# EasyEDA Pro project evenVCO.eprj, schematic main_1
Board Name: main_TH; Create Date: 2025-12-28; Page Name: main; Project Name: comparatorVCO; Schematic Name: main_1; Update Date: 2025-12-28; Company: EasyEDA.com; Page Size: A4; Version: V1.0
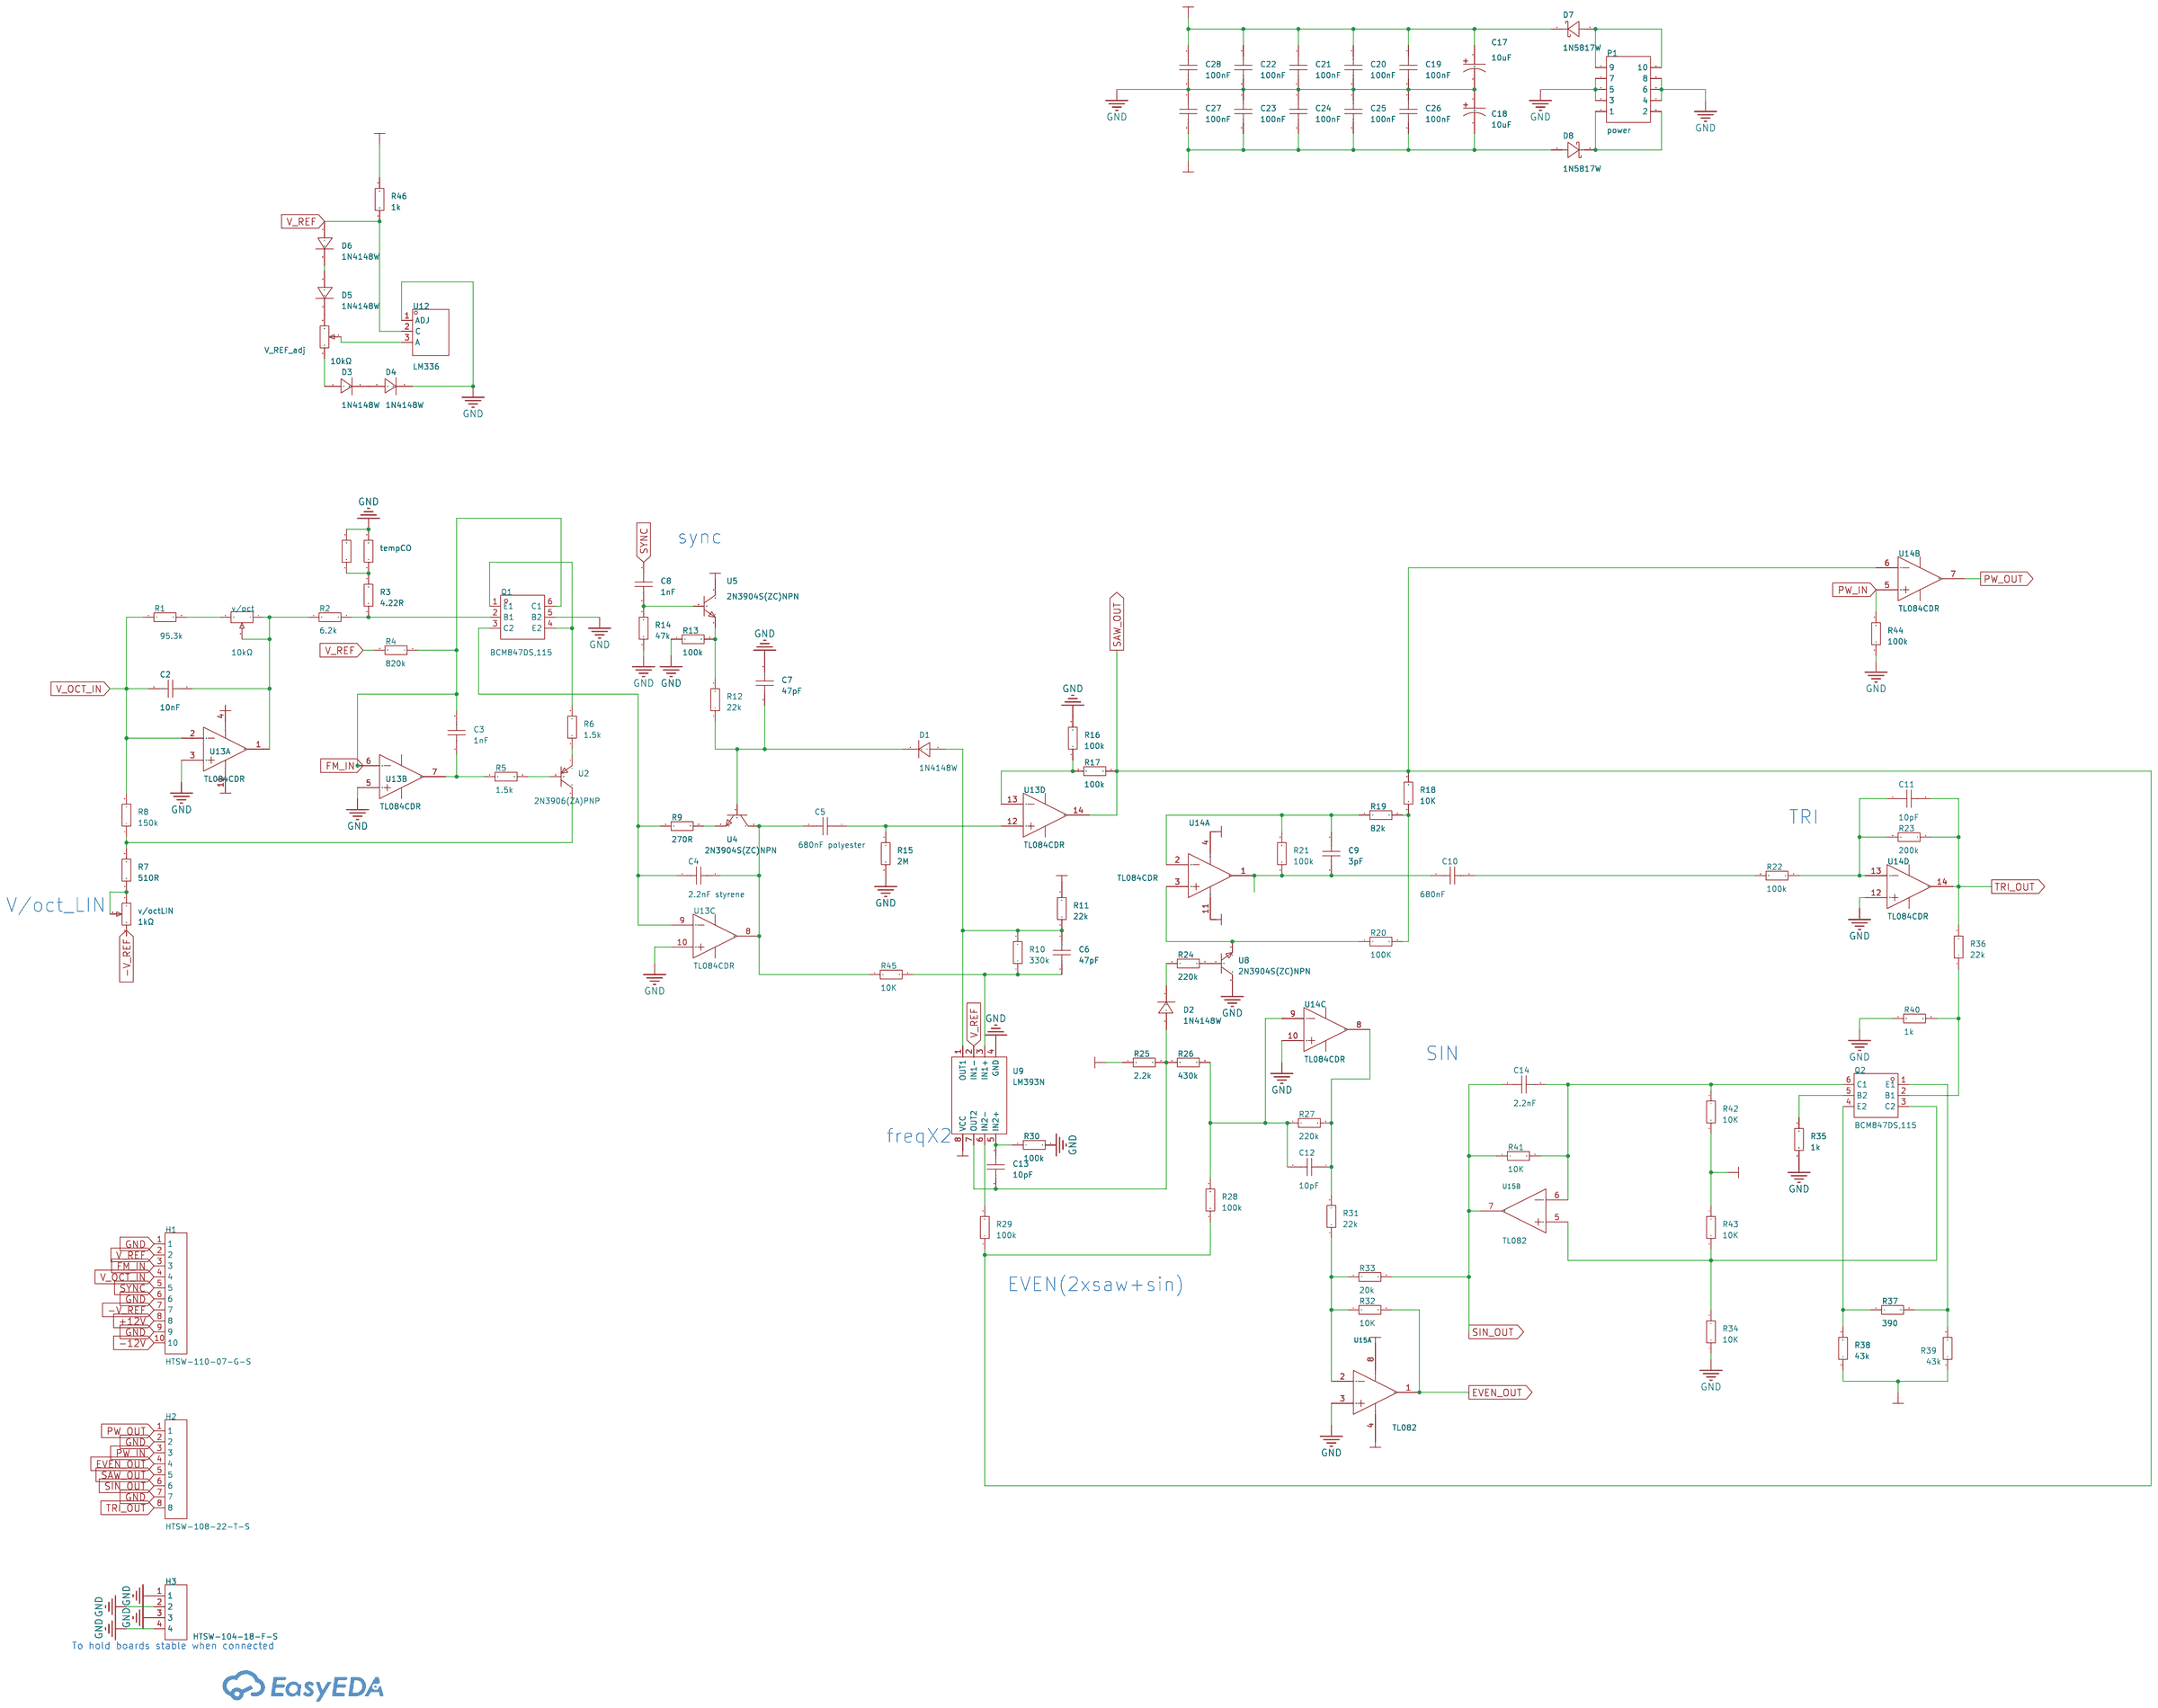
[diagram p2: schematic sheet]

## Parts
C2  10nF  [CAP-TH_L2.5-W2.3-P1.80-D0.4]
C3  1nF  [CAP-TH_L2.5-W2.3-P1.80-D0.4]
C4  2.2nF styrene  [CAP-TH_L5.0-W2.1-P4.60-D0.4]
C5  680nF polyester  [CAP-TH_L5.0-W2.1-P4.60-D0.4]
C6  47pF  [CAP-TH_L2.5-W2.3-P1.80-D0.4]
C7  47pF  [CAP-TH_L2.5-W2.3-P1.80-D0.4]
C8  1nF  [CAP-TH_L2.5-W2.3-P1.80-D0.4]
C9  3pF  [CAP-TH_L2.5-W2.3-P1.80-D0.4]
C10  680nF  [CAP-TH_L5.0-W2.1-P4.60-D0.4]
C11  10pF  [CAP-TH_L2.5-W2.3-P1.80-D0.4]
C12  10pF  [CAP-TH_L2.5-W2.3-P1.80-D0.4]
C13  10pF  [CAP-TH_L2.5-W2.3-P1.80-D0.4]
C14  2.2nF  [CAP-TH_L5.0-W2.1-P4.60-D0.4]
C17  10uF  [CAP-TH_L2.5-W2.3-P1.80-D0.4]
C18  10uF  [CAP-TH_L2.5-W2.3-P1.80-D0.4]
C19  100nF  [CAP-TH_L2.5-W2.3-P1.80-D0.4]
C20  100nF  [CAP-TH_L2.5-W2.3-P1.80-D0.4]
C21  100nF  [CAP-TH_L2.5-W2.3-P1.80-D0.4]
C22  100nF  [CAP-TH_L2.5-W2.3-P1.80-D0.4]
C23  100nF  [CAP-TH_L2.5-W2.3-P1.80-D0.4]
C24  100nF  [CAP-TH_L2.5-W2.3-P1.80-D0.4]
C25  100nF  [CAP-TH_L2.5-W2.3-P1.80-D0.4]
C26  100nF  [CAP-TH_L2.5-W2.3-P1.80-D0.4]
C27  100nF  [CAP-TH_L2.5-W2.3-P1.80-D0.4]
C28  100nF  [CAP-TH_L2.5-W2.3-P1.80-D0.4]
D1  1N4148W  [SOD-123F_L2.7-W1.6-LS3.8-RD]
D2  1N4148W  [SOD-123F_L2.7-W1.6-LS3.8-RD]
D3  1N4148W  [SOD-123F_L2.7-W1.6-LS3.8-RD]
D4  1N4148W  [SOD-123F_L2.7-W1.6-LS3.8-RD]
D5  1N4148W  [SOD-123F_L2.7-W1.6-LS3.8-RD]
D6  1N4148W  [SOD-123F_L2.7-W1.6-LS3.8-RD]
D7  1N5817W  [SOD-123_L2.8-W1.8-LS3.7-RD]
D8  1N5817W  [SOD-123_L2.8-W1.8-LS3.7-RD]
H1  HTSW-110-07-G-S  [HDR-TH_TSW-110-17-F-S-LL]
H2  HTSW-108-22-T-S  [HDR-TH_HTSW-108-22-T-S]
H3  HTSW-104-18-F-S  [HDR-TH_HTSW-104-25-S-S-LL]
P1  power  [IDC-TH_10P-P2.54_C5665]
Q1  BCM847DS,115  [SC-74-6_L2.9-W1.5-P0.95-LS2.8-BR]
Q2  BCM847DS,115  [SC-74-6_L2.9-W1.5-P0.95-LS2.8-BR]
R1  95.3k  [RES-TH_BD1.8-L3.5-P7.50-D0.5]
R2  6.2k  [RES-TH_BD1.8-L3.5-P7.50-D0.5]
R3  4.22R  [RES-TH_BD1.8-L3.5-P7.50-D0.5]
R4  820k  [RES-TH_BD1.8-L3.5-P7.50-D0.5]
R5  1.5k  [RES-TH_BD1.8-L3.5-P7.50-D0.5]
R6  1.5k  [RES-TH_BD1.8-L3.5-P7.50-D0.5]
R7  510R  [RES-TH_BD1.8-L3.5-P7.50-D0.5]
R8  150k  [RES-TH_BD1.8-L3.5-P7.50-D0.5]
R9  270R  [RES-TH_BD1.8-L3.5-P7.50-D0.5]
R10  330k  [RES-TH_BD1.8-L3.5-P7.50-D0.5]
R11  22k  [RES-TH_BD1.8-L3.5-P7.50-D0.5]
R12  22k  [RES-TH_BD1.8-L3.5-P7.50-D0.5]
R13  100k  [RES-TH_BD1.8-L3.5-P7.50-D0.5]
R14  47k  [RES-TH_BD1.8-L3.5-P7.50-D0.5]
R15  2M  [RES-TH_BD1.8-L3.5-P7.50-D0.5]
R16  100k  [RES-TH_BD1.8-L3.5-P7.50-D0.5]
R17  100k  [RES-TH_BD1.8-L3.5-P7.50-D0.5]
R18  10K  [RES-TH_BD1.8-L3.5-P7.50-D0.5]
R19  82k  [RES-TH_BD1.8-L3.5-P7.50-D0.5]
R20  100K  [RES-TH_BD1.8-L3.5-P7.50-D0.5]
R21  100k  [RES-TH_BD1.8-L3.5-P7.50-D0.5]
R22  100k  [RES-TH_BD1.8-L3.5-P7.50-D0.5]
R23  200k  [RES-TH_BD1.8-L3.5-P7.50-D0.5]
R24  220k  [RES-TH_BD1.8-L3.5-P7.50-D0.5]
R25  2.2k  [RES-TH_BD1.8-L3.5-P7.50-D0.5]
R26  430k  [RES-TH_BD1.8-L3.5-P7.50-D0.5]
R27  220k  [RES-TH_BD1.8-L3.5-P7.50-D0.5]
R28  100k  [RES-TH_BD1.8-L3.5-P7.50-D0.5]
R29  100k  [RES-TH_BD1.8-L3.5-P7.50-D0.5]
R30  100k  [RES-TH_BD1.8-L3.5-P7.50-D0.5]
R31  22k  [RES-TH_BD1.8-L3.5-P7.50-D0.5]
R32  10K  [RES-TH_BD1.8-L3.5-P7.50-D0.5]
R33  20k  [RES-TH_BD1.8-L3.5-P7.50-D0.5]
R34  10K  [RES-TH_BD1.8-L3.5-P7.50-D0.5]
R35  1k  [RES-TH_BD1.8-L3.5-P7.50-D0.5]
R36  22k  [RES-TH_BD1.8-L3.5-P7.50-D0.5]
R37  390  [RES-TH_BD1.8-L3.5-P7.50-D0.5]
R38  43k  [RES-TH_BD1.8-L3.5-P7.50-D0.5]
R39  43k  [RES-TH_BD1.8-L3.5-P7.50-D0.5]
R40  1k  [RES-TH_BD1.8-L3.5-P7.50-D0.5]
R41  10K  [RES-TH_BD1.8-L3.5-P7.50-D0.5]
R42  10K  [RES-TH_BD1.8-L3.5-P7.50-D0.5]
R43  10K  [RES-TH_BD1.8-L3.5-P7.50-D0.5]
R44  100k  [RES-TH_BD1.8-L3.5-P7.50-D0.5]
R45  10K  [RES-TH_BD1.8-L3.5-P7.50-D0.5]
R46  1k  [RES-TH_BD1.8-L3.5-P7.50-D0.5]
RTemp  10kΩ  [RES-TH_BD1.8-L3.2-P7.20-D0.4]
tempCO  100R_3500ppm  [R0603]
U2  2N3906(ZA)PNP  [SOT-23-3_L2.9-W1.3-P0.95-LS2.4-BR]
U4  2N3904S(ZC)NPN  [SOT-23-3_L2.9-W1.3-P0.95-LS2.4-BR]
U5  2N3904S(ZC)NPN  [SOT-23-3_L2.9-W1.3-P0.95-LS2.4-BR]
U8  2N3904S(ZC)NPN  [SOT-23-3_L2.9-W1.3-P0.95-LS2.4-BR]
U9  LM393N  [DIP-8_L9.7-W6.4-P2.54-LS7.6-BL]
U12  LM336  [TO-92-3_L4.9-W3.7-P1.27-L]
U13  TL084CDR  [PDIP-14_L19.3-W6.4-P2.54-LS7.9-BL-1]  (sections 1,2,3,4)
U14  TL084CDR  [PDIP-14_L19.3-W6.4-P2.54-LS7.9-BL-1]  (sections 1,2,3,4)
U15  TL082  [DIP-8_L9.7-W6.4-P2.54-LS7.6-BL]  (sections 1,2)
v/oct  10kΩ  [RES-ADJ-TH_3P-L10.0-W10.0-P2.50-L]
v/octLIN  1kΩ  [RES-ADJ-TH_3P-L10.0-W10.0-P2.50-L]
V_REF_adj  10kΩ  [RES-ADJ-TH_3P-L10.0-W10.0-P2.50-L]

## Library data of the parts
C2-C14 C19-C28 = CAP_0805: Supplier Footprint: 0805; Supplier Part: C282732
C17 C18 = 450BXW10MEFR10X16: Capacitance: Tolerance:±20% Tolerance:±20% Rated Voltage: Ripple Current:325mA@100kHz Equivalent Series Resistance(ESR):- Lead Spacing: φD: L: Lifetime @ Temp:10000hrs@105℃ Operating Temperature:-40℃~+105℃ Operating Temperature:-40℃~+105℃; LCSC Part Name: 10uF ±20% 450V; Supplier Part: C473172; Manufacturer: rubycon(红宝石); Supplier Footprint: 插件,D10xL16mm; JLCPCB Part Class: Extended Part; Datasheet: https://atta.szlcsc.com/upload/public/pdf/source/20191223/C473225_F386740271D4F9A16F81F2D6CB648B12.pdf; Supplier: LCSC; Tolerance: ±20%; Ripple Current: 325mA@100kHz; Lifetime @ Temp: 10000hrs@105℃; Operating Temperature: -40℃~+105℃
D1-D6 = 1N4148W_C81598: Diode Configuration:Independent Voltage - Forward(Vf@If):1V@50mA Voltage - DC Reverse(Vr):75V Current - Rectified:150mA Pd - Power Dissipation:400mW Reverse Leakage Current (Ir):1uA@75V Reverse Recovery Time (trr):4ns Operating Junction Temperature Range:; Supplier Part: C81598; Manufacturer: ST(先科); Supplier Footprint: SOD-123; JLCPCB Part Class: Basic Part; Datasheet: https://item.szlcsc.com/datasheet/1N4148W/82750.html; Supplier: LCSC; Diode Configuration: Independent; Voltage - Forward(Vf@If): 1V@50mA; Voltage - DC Reverse(Vr): 75V; Current - Rectified: 150mA; Pd - Power Dissipation: 400mW; Reverse Leakage Current (Ir): 1uA@75V; Reverse Recovery Time (trr): 4ns; Non-Repetitive Peak Forward Surge Current: 1A
D7 D8 = 1N5817W_C7473302: Diode Configuration:Independent Voltage - Forward(Vf@If):450mV@1A Voltage - DC Reverse(Vr):20V Current - Rectified:1A Reverse Leakage Current (Ir):1mA@20V Operating Junction Temperature Range:-40℃~+125℃ Operating Junction Temperature Range:-40℃~+125℃ Non-; LCSC Part Name: 电压:20V 电流:1A; Supplier Part: C7473302; Manufacturer: HXY MOSFET(华轩阳电子); Supplier Footprint: SOD-123; JLCPCB Part Class: Extended Part; Datasheet: https://item.szlcsc.com/datasheet/1N5817W/8533868.html; Supplier: LCSC; Diode Configuration: Independent; Voltage - Forward(Vf@If): 450mV@1A; Voltage - DC Reverse(Vr): 20V; Current - Rectified: 1A; Reverse Leakage Current (Ir): 1mA@20V; Operating Junction Temperature Range: -40℃~+125℃; Non-Repetitive Peak Forward Surge Current: 9A
H1 = HTSW-110-07-G-S: Pitch:2.54mm Mounting Type:Through Hole Number of Rows:1 Number of Pins:10P Contact Material:Phosphor Bronze Contact Plating:Gold Operating Temperature:-55℃~+125℃ Operating Temperature:-55℃~+125℃; LCSC Part Name: 间距:2.54mm 直插; Supplier Part: C7286348; Manufacturer: SAMTEC; Supplier Footprint: 插件,P=2.54mm; JLCPCB Part Class: Extended Part; Datasheet: https://item.szlcsc.com/datasheet/HTSW-110-07-G-S/8255757.html; Supplier: LCSC; Pitch: 2.54mm; Mounting Type: Through Hole; Number of Rows: 1; Number of Pins: 10P; Contact Material: Phosphor Bronze; Contact Plating: Gold; Operating Temperature: -55℃~+125℃
H2 = HTSW-108-22-T-S: Pitch:2.54mm Mounting Type:Through Hole Number of Rows:1 Number of Pins:8P Contact Material:Phosphor Bronze Contact Plating:Tin Operating Temperature:-55℃~+105℃ Operating Temperature:-55℃~+105℃; LCSC Part Name: 间距:2.54mm 直插; Supplier Part: C6877799; Manufacturer: SAMTEC; Supplier Footprint: 插件,P=2.54mm; Datasheet: https://item.szlcsc.com/datasheet/HTSW-108-22-T-S/7841687.html; Supplier: LCSC; Pitch: 2.54mm; Mounting Type: Through Hole; Number of Rows: 1; Number of Pins: 8P; Contact Material: Phosphor Bronze; Contact Plating: Tin; Operating Temperature: -55℃~+105℃
H3 = HTSW-104-18-F-S: Pitch:2.54mm Mounting Type:Through Hole Number of Rows:1 Number of Pins:4P Contact Material:Phosphor Bronze Contact Plating:Tin Operating Temperature:-55℃~+125℃ Operating Temperature:-55℃~+125℃; LCSC Part Name: 间距:2.54mm 直插; Supplier Part: C7286115; Manufacturer: SAMTEC; Supplier Footprint: 插件,P=2.54mm; JLCPCB Part Class: Extended Part; Datasheet: https://item.szlcsc.com/datasheet/HTSW-104-18-F-S/8255523.html; Supplier: LCSC; Pitch: 2.54mm; Mounting Type: Through Hole; Number of Rows: 1; Number of Pins: 4P; Contact Material: Phosphor Bronze; Contact Plating: Tin; Operating Temperature: -55℃~+125℃
P1 = 2.54-2*5P简牛: Connector Type:IDC Header Pitch:2.54mm Number of Positions or Pins:2x5P Holder Type:Through Hole Row Spacing:2.54mm Number of Rows:2 Number of PINs Per Row:5 Contact Material:- Contact Plating:-; LCSC Part Name: 2.54mm 2x5P 排数:2 每排P数:5; Supplier Part: C5665; Manufacturer: BOOMELE(博穆精密); Supplier Footprint: 插件,P=2.54mm; JLCPCB Part Class: Extended Part; Datasheet: https://item.szlcsc.com/datasheet/2.54-2*5P%25E7%25AE%2580%25E7%2589%259B/6118.html; Supplier: LCSC; Connector Type: IDC Header; Pitch: 2.54mm; Number of Positions or Pins: 2x5P; Holder Type: Through Hole; Row Spacing: 2.54mm; Number of Rows: 2; Number of PINs Per Row: 5
Q1 Q2 = BCM847DS,115: type:NPN Current - Collector(Ic):100mA Collector - Emitter Voltage VCEO:45V Pd - Power Dissipation:250mW DC Current Gain:200@2mA,5V DC Current Gain:200@2mA,5V Transition frequency(fT):250MHz Current - Collector Cutoff:5uA Vce Saturation(VCE(sat)):200mV Op; LCSC Part Name: NPN 电流:100mA 电压:45V; Supplier Part: C549558; Manufacturer: Nexperia(安世); Supplier Footprint: SC-74; JLCPCB Part Class: Extended Part; Datasheet: https://item.szlcsc.com/datasheet/BCM847DS%252C115/570639.html; Supplier: LCSC; type: NPN; Current - Collector(Ic): 100mA; Collector - Emitter Voltage VCEO: 45V; Pd - Power Dissipation: 250mW; DC Current Gain: 200@2mA,5V; Transition frequency(fT): 250MHz; Current - Collector Cutoff: 5uA; Vce Saturation(VCE(sat)): 200mV; Operating Temperature: -65℃~+150℃; Emitter-Base Voltage(Vebo): 6V; Number: 2 NPN
R1-R44 = Res_0805: Supplier Footprint: 0805; Supplier Part: C141518
R45 R46 = Res_0805: Supplier Footprint: 0603; FootprintName: R0805; Supplier Part: C141518
RTemp = Res_AXIAL-1/8W: Supplier Footprint: Through
tempCO = PTS060301B100RP100: Temperature Range:-55℃~+155℃ Temperature Range:-55℃~+155℃; LCSC Part Name: 铂金SMD扁平芯片温度传感器; Supplier Part: C141518; Manufacturer: VISHAY(威世); Supplier Footprint: 0603; JLCPCB Part Class: Extended Part; Datasheet: https://item.szlcsc.com/datasheet/PTS060301B100RP100/152849.html; Supplier: LCSC; Temperature Range: -55℃~+155℃; FootprintName: R0805
U2 = 2N3906(ZA)PNP: Supplier Part: C49023424; Supplier Footprint: SOT-23; JLCPCB Part Class: Extended Part; Supplier: LCSC
U4 U5 U8 = 2N3904S(ZC)NPN: Supplier Part: C9900013034; Supplier Footprint: SOT-23; JLCPCB Part Class: Extended Part; Supplier: LCSC
U9 = LM393N: Number of Channels:2 Vos - Input Offset Voltage:2mV Ib - Input Bias Current:100nA Output Type:Open Drain Quiescent Current:600uA Operating Temperature:0℃~+70℃ Operating Temperature:0℃~+70℃ Maximum Power Supply Range (Vdd-Vss):36V Single Supply:2V~32V Sing; LCSC Part Name: 双路差分比较器; Supplier Part: C19708139; Manufacturer: HGSEMI(华冠); Supplier Footprint: DIP-8; JLCPCB Part Class: Extended Part; Datasheet: https://item.szlcsc.com/datasheet/LM393N/771556.html; Supplier: LCSC; Number of Channels: 2; Vos - Input Offset Voltage: 2mV; Ib - Input Bias Current: 100nA; Output Type: Open Drain; Quiescent Current: 600uA; Operating Temperature: 0℃~+70℃; Maximum Power Supply Range (Vdd-Vss): 36V; Single Supply: 2V~32V; Dual Supply: ±16V; Input Offset Current(Ios): 5nA
U12 = LM336: Supplier Part: C9406; Supplier Footprint: TO-92-3; JLCPCB Part Class: Extended Part; Supplier: LCSC
U13 U14 = TL084CDR: Number of Channels:- Gain Bandwidth Product:3MHz Ib - Input Bias Current:30pA Vos - Input Offset Voltage:15mV Common Mode Rejection Ratio(CMRR):86dB Slew Rate:13V/us Quiescent Current(Iq):1.4mA Rail To Rail:- Input Offset Voltage Drift(Vos TC):18uV/℃ Inpu; LCSC Part Name: TL08xx 结型场效应晶体管输入运算放大器; Supplier Part: C8956; Manufacturer: TI(德州仪器); Supplier Footprint: SOIC-14; JLCPCB Part Class: Extended Part; Datasheet: https://www.ti.com/cn/lit/gpn/tl084; Supplier: LCSC; Gain Bandwidth Product: 3MHz; Ib - Input Bias Current: 30pA; Vos - Input Offset Voltage: 15mV; Common Mode Rejection Ratio(CMRR): 86dB; Slew Rate: 13V/us; Quiescent Current(Iq): 1.4mA; Input Offset Voltage Drift(Vos TC): 18uV/℃
U15 = TL082: Number of Channels:- Gain Bandwidth Product:3MHz Ib - Input Bias Current:2.5nA Vos - Input Offset Voltage:3mV Common Mode Rejection Ratio(CMRR):85dB Slew Rate:13V/us Quiescent Current(Iq):1.4mA Rail To Rail:- Input Offset Voltage Drift(Vos TC):- Input Off; Supplier Part: C9385; Manufacturer: Gcore(扬州国芯); Supplier Footprint: SOP-8; JLCPCB Part Class: Extended Part; Datasheet: https://item.szlcsc.com/datasheet/TL082/5796627.html; Supplier: LCSC; Gain Bandwidth Product: 3MHz; Ib - Input Bias Current: 2.5nA; Vos - Input Offset Voltage: 3mV; Common Mode Rejection Ratio(CMRR): 85dB; Slew Rate: 13V/us; Quiescent Current(Iq): 1.4mA
v/oct = CT-94EW103: Resistance: Tolerance:±10% Tolerance:±10%; LCSC Part Name: 10kΩ ±10%; Supplier Part: C118954; Manufacturer: NIDEC(尼得科); Supplier Footprint: 插件; JLCPCB Part Class: Extended Part; Datasheet: https://atta.szlcsc.com/upload/public/pdf/source/20220330/4F21B15310F98CE40EAAD820485D2759.pdf; Supplier: LCSC; Tolerance: ±10%
v/octLIN V_REF_adj = R_3296: Supplier Footprint: Through; Supplier Part: C118954

## Nets
+12V: C17.1 C19.1 C20.1 C21.1 C22.1 C28.1 D7.1(K) H1.8 R11.2 R25.1 R42.2 R43.1 R46.2 U5.3(C) U9.8(VCC) U13.4(VCC+) U14.4(VCC+) U15.8(VCC+)
-12V: C18.2 C23.2 C24.2 C25.2 C26.2 C27.2 D8.2(A) H1.10 R38.1 R39.1 U13.11(VCC-) U14.11(VCC-) U15.4(VCC-)
GND: C7.1 C17.2 C18.1 C19.2 C20.2 C21.2 C22.2 C23.1 C24.1 C25.1 C26.1 C27.1 C28.2 D4.2(C) H1.1 H1.6 H1.9 H2.2 H2.7 H3.1 H3.2 H3.3 H3.4 P1.3 P1.4 P1.5 P1.6 P1.7 P1.8 Q1.5(B2) R13.1 R14.1 R15.2 R16.2 R30.2 R34.1 R35.2 R40.1 R44.1 RTemp.2 tempCO.2 U8.3(C) U9.4(GND) U12.1(ADJ) U13.3(IN1+) U13.5(IN2+) U13.10(IN3+) U14.10(IN3+) U14.12(IN4+) U15.3(1IN+)
-V_REF: H1.7 v/octLIN.3
EVEN_OUT: H2.4 R32.2 U15.1(1OUT)
FM_IN: C3.2 H1.3 Q1.6(C1) R4.1 U13.6(IN2-)
PW_IN: H2.3 R44.2 U14.5(IN2+)
PW_OUT: H2.1 U14.7(OUT2)
SAW_OUT: H2.5 R17.1 R18.2 R28.1 R29.1 U13.14(OUT4) U14.6(IN2-)
SIN_OUT: C14.1 H2.6 R33.2 R41.1 U15.7(2OUT)
SYNC: C8.1 H1.5
TRI_OUT: C11.2 H2.8 R23.1 R36.2 U14.14(OUT4)
V_OCT_IN: C2.2 H1.4 R1.1 R8.2 U13.2(IN1-)
V_REF: D6.1(A) H1.2 R4.2 R46.1 U9.2(IN1-) U12.2(C)
$1N507: R1.2 v/oct.3
$1N1389: C3.1 R5.1 U13.7(OUT2)
$1N1507: R5.2 U2.2(B)
$1N1586: R6.1 U2.1(E)
$1N1640: R7.2 R8.1 U2.3(C)
$1N1719: R7.1 v/octLIN.1 v/octLIN.2
$1N2016: C4.1 Q1.3(C2) R9.1 U13.9(IN3-)
$1N2204: R9.2 U4.2(E)
$1N2447: C6.1 D1.1(A) R10.2 R11.1 U9.1(OUT1)
$1N2683: C5.1 R15.1 U13.12(IN4+)
$1N2690: R3.2 RTemp.1 tempCO.1
$1N2936: Q1.1(E1) Q1.4(E2) R6.2
$1N2959: Q1.2(B1) R2.2 R3.1
$1N3105: C7.2 D1.2(C) R12.1 U4.1(B)
$1N3116: C4.2 C5.2 R45.1 U4.3(C) U13.8(OUT3)
$1N3938: C8.2 R14.2 U5.1(B)
$1N3981: R12.2 R13.2 U5.2(E)
$1N4358: R16.1 R17.2 U13.13(IN4-)
$1N4747: R20.1 U8.2(E) U14.3(IN1+)
$1N4955: R18.1 R19.2 R20.2
$1N5308: C11.1 R22.1 R23.2 U14.13(IN4-)
$1N5674: R24.2 U8.1(B)
$1N5714: D2.2(C) R24.1
$1N6127: C6.2 R10.1 R45.2 U9.3(IN1+)
$1N6419: R29.2 U9.6(IN2-)
$1N6424: C13.1 R30.1 U9.5(IN2+)
$1N6566: C13.2 D2.1(A) R25.2 R26.1 U9.7(OUT2)
$1N7314: Q2.2(B1) R36.1 R40.2
$1N7370: Q2.4(E2) R37.1 R38.2
$1N7375: Q2.1(E1) R37.2 R39.2
$1N8230: D3.1(A) V_REF_adj.1
$1N8312: U12.3(A) V_REF_adj.2
$1N8440: D3.2(C) D4.1(A)
$1N8647: D5.1(A) D6.2(C)
$1N8687: D5.2(C) V_REF_adj.3
$1N9074: D8.1(K) P1.1 P1.2
$1N9101: D7.2(A) P1.9 P1.10
$1N9891: C2.1 R2.1 U13.1(OUT1) v/oct.1 v/oct.2
$1N10311: C9.2 C10.1 R21.2 U14.1(OUT1)
$1N10325: C9.1 R19.1 R21.1 U14.2(IN1-)
$1N10403: C12.2 R26.2 R27.1 R28.2 U14.9(IN3-)
$1N10523: C10.2 R22.2
$1N10728: Q2.3(C2) R34.2 R43.2 U15.5(2IN+)
$1N10768: C14.2 Q2.6(C1) R41.2 R42.1 U15.6(2IN-)
$1N10882: R31.1 R32.1 R33.1 U15.2(1IN-)
$1N10889: C12.1 R27.2 R31.2 U14.8(OUT3)
$1N11135: Q2.5(B2) R35.1

## Notes on the sheet
- sync
- TRI
- V/oct_LIN
- SIN
- freqX2
- EVEN(2xsaw+sin)
- To hold boards stable when connected
